# Altium project power-v3.5.PrjPCB (part 1 of 2)
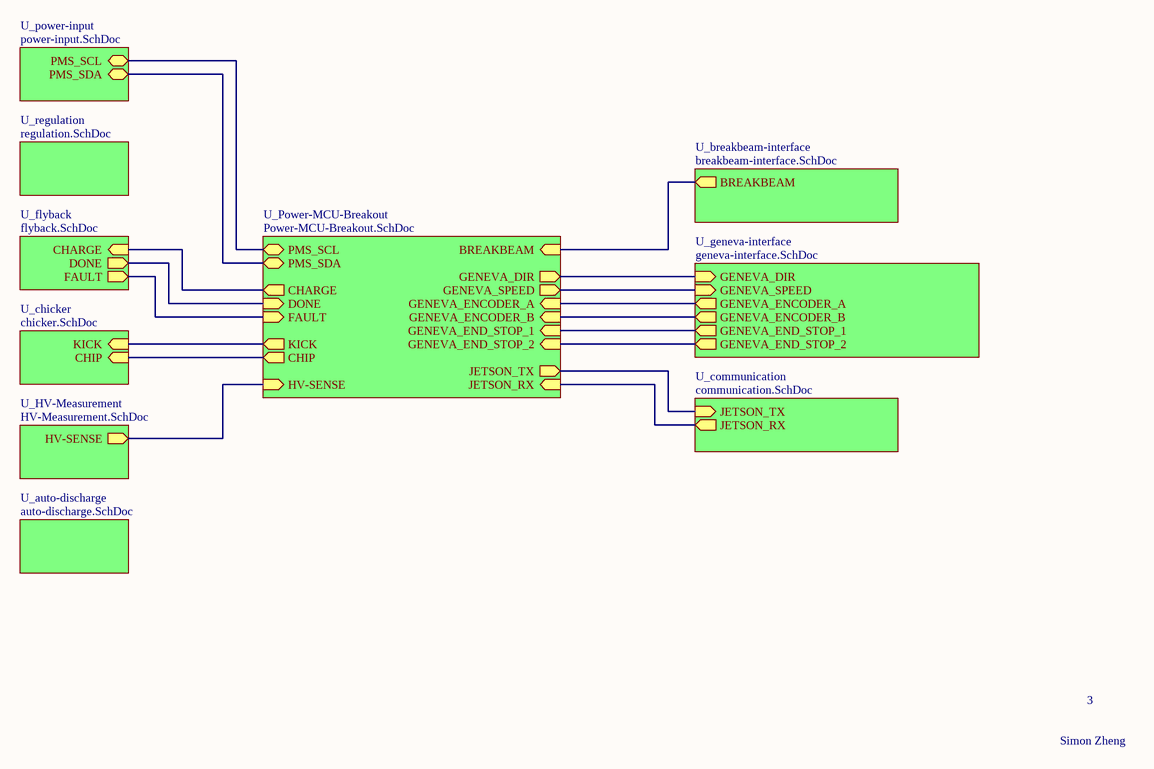
[diagram p0: power-v3.5.SchDoc]
11 sheets, 254 parts. Net scope: hierarchical (ports join the sheet entries above them; power ports are global).
Board files: power-v3.2-exp.PcbDoc, power-v3.5.PcbDoc
Sheets:
  power-v3.5.SchDoc
    U_auto-discharge = auto-discharge.SchDoc
    U_breakbeam-interface = breakbeam-interface.SchDoc
    U_chicker = chicker.SchDoc
    U_communication = communication.SchDoc
    U_flyback = flyback.SchDoc
    U_geneva-interface = geneva-interface.SchDoc
    U_HV-Measurement = HV-Measurement.SchDoc
    U_power-input = power-input.SchDoc
    U_Power-MCU-Breakout = Power-MCU-Breakout.SchDoc
    U_regulation = regulation.SchDoc

## Sheet power-v3.5.SchDoc
size A4; SheetNumber: 1

### Sub-sheets
U_auto-discharge = auto-discharge.SchDoc: no entries
U_breakbeam-interface = breakbeam-interface.SchDoc: BREAKBEAM (out)
U_chicker = chicker.SchDoc: CHIP (in), KICK (in)
U_communication = communication.SchDoc: JETSON_TX (in), JETSON_RX (out)
U_flyback = flyback.SchDoc: CHARGE (in), FAULT (out), DONE (out)
U_geneva-interface = geneva-interface.SchDoc: GENEVA_SPEED (in), GENEVA_ENCODER_A (out), GENEVA_ENCODER_B (out), GENEVA_DIR (in), GENEVA_END_STOP_1 (out), GENEVA_END_STOP_2 (out)
U_HV-Measurement = HV-Measurement.SchDoc: HV-SENSE (out)
U_power-input = power-input.SchDoc: PMS_SDA (bidir), PMS_SCL (bidir)
U_Power-MCU-Breakout = Power-MCU-Breakout.SchDoc: GENEVA_END_STOP_1 (in), GENEVA_END_STOP_2 (in), HV-SENSE (in), BREAKBEAM (in), FAULT (in), DONE (in), CHARGE (out), GENEVA_DIR (out), JETSON_TX (out), JETSON_RX (in), GENEVA_ENCODER_A (in), GENEVA_ENCODER_B (in), GENEVA_SPEED (out), KICK (out), CHIP (out), PMS_SCL (bidir), PMS_SDA (bidir)
U_regulation = regulation.SchDoc: no entries

### Nets
BREAKBEAM: sheet U_breakbeam-interface/BREAKBEAM, sheet U_Power-MCU-Breakout/BREAKBEAM
CHARGE: sheet U_flyback/CHARGE, sheet U_Power-MCU-Breakout/CHARGE
CHIP: sheet U_chicker/CHIP, sheet U_Power-MCU-Breakout/CHIP
DONE: sheet U_flyback/DONE, sheet U_Power-MCU-Breakout/DONE
FAULT: sheet U_flyback/FAULT, sheet U_Power-MCU-Breakout/FAULT
GENEVA_DIR: sheet U_geneva-interface/GENEVA_DIR, sheet U_Power-MCU-Breakout/GENEVA_DIR
GENEVA_ENCODER_A: sheet U_geneva-interface/GENEVA_ENCODER_A, sheet U_Power-MCU-Breakout/GENEVA_ENCODER_A
GENEVA_ENCODER_B: sheet U_geneva-interface/GENEVA_ENCODER_B, sheet U_Power-MCU-Breakout/GENEVA_ENCODER_B
GENEVA_END_STOP_1: sheet U_geneva-interface/GENEVA_END_STOP_1, sheet U_Power-MCU-Breakout/GENEVA_END_STOP_1
GENEVA_END_STOP_2: sheet U_geneva-interface/GENEVA_END_STOP_2, sheet U_Power-MCU-Breakout/GENEVA_END_STOP_2
GENEVA_SPEED: sheet U_geneva-interface/GENEVA_SPEED, sheet U_Power-MCU-Breakout/GENEVA_SPEED
HV-SENSE: sheet U_HV-Measurement/HV-SENSE, sheet U_Power-MCU-Breakout/HV-SENSE
JETSON_RX: sheet U_communication/JETSON_RX, sheet U_Power-MCU-Breakout/JETSON_RX
JETSON_TX: sheet U_communication/JETSON_TX, sheet U_Power-MCU-Breakout/JETSON_TX
KICK: sheet U_chicker/KICK, sheet U_Power-MCU-Breakout/KICK
PMS_SCL: sheet U_power-input/PMS_SCL, sheet U_Power-MCU-Breakout/PMS_SCL
PMS_SDA: sheet U_power-input/PMS_SDA, sheet U_Power-MCU-Breakout/PMS_SDA

### Notes on the sheet
- 3
- Simon Zheng

## Sheet auto-discharge.SchDoc
size A; SheetNumber: 5
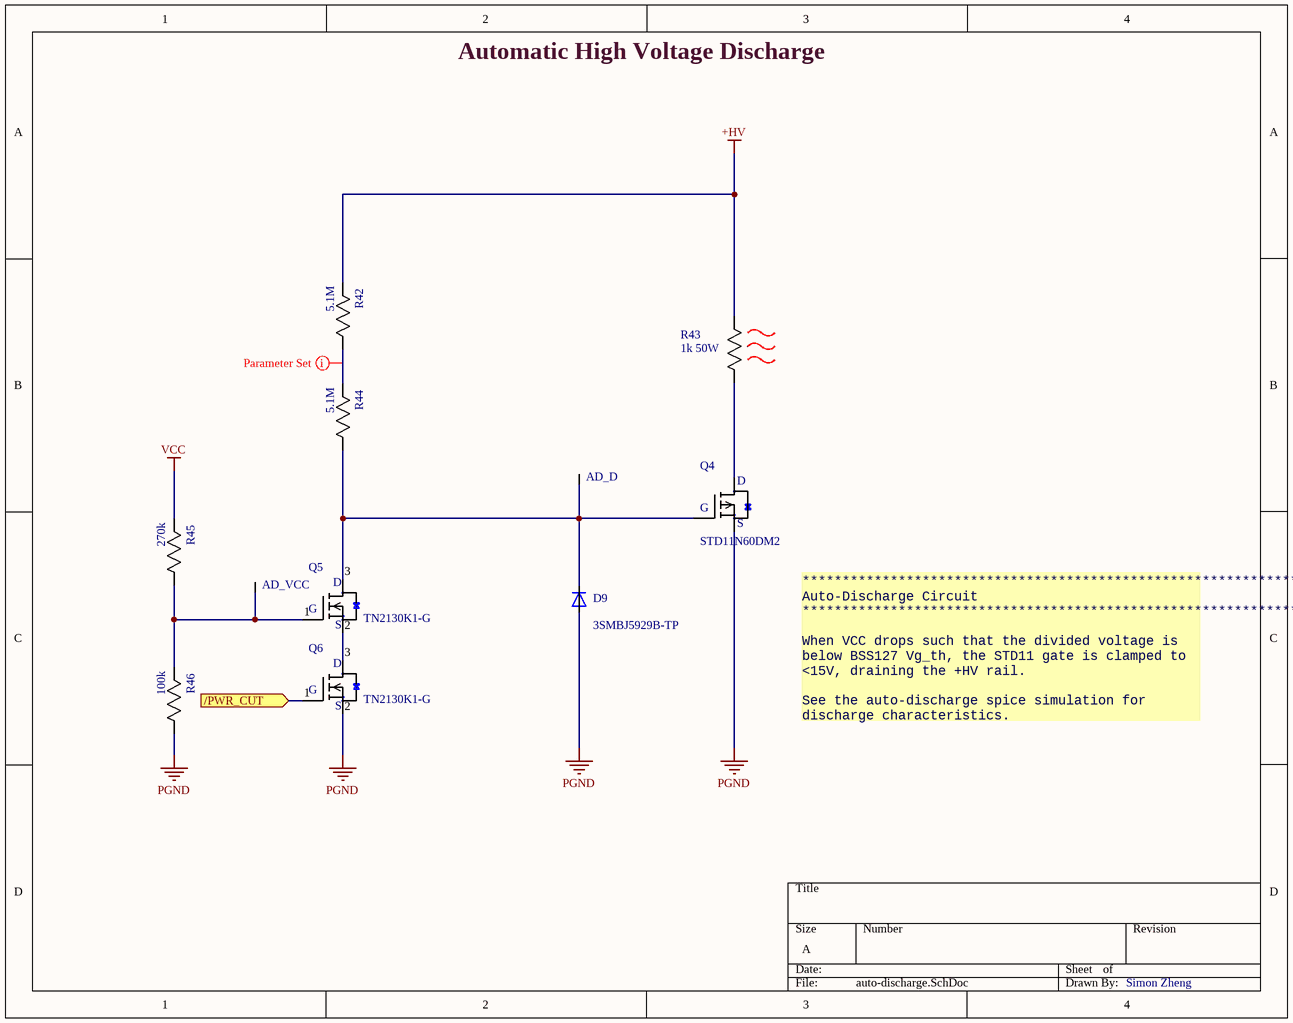
[diagram p1: auto-discharge.SchDoc]

### Parts
AD_D  Test Point (Via)  [TP]  (value not drawn)  (no BOM)
AD_VCC  Test Point (Via)  [TP]  (value not drawn)  (no BOM)
D9  3SMBJ5929B-TP  [DO-214AA]
Q4  STD11N60DM2  [DPAK (TO-252)]
Q5  TN2130K1-G  [SOT95P237X112-3N]
Q6  TN2130K1-G  [SOT95P237X112-3N]
R42  5.1M  [0603]
R43  1k 50W  [D2PAK (TO-263)]
R44  5.1M  [0603]
R45  270k  [0603]
R46  100k  [0603]

### Ports
/PWR_CUT (in)

### Nets
+HV: R42.2(R2) R43.2(R2)
PGND: D9.A Q4.S Q6.2(S) R46.1(R1)
VCC: R45.2(R2)
/PWR_CUT: Q6.1(G) ; port /PWR_CUT
NetAD_D_1: AD_D.1 D9.C Q4.G Q5.3(D) R44.1(R1)
NetAD_VCC_1: AD_VCC.1 Q5.1(G) R45.1(R1) R46.2(R2)
NetQ4_D: Q4.D R43.1(R1)
NetQ5_2: Q5.2(S) Q6.3(D)
NetR42_1: R42.1(R1) R44.2(R2)

Not connected (* = marked no-connect by the designer): R43 3

### Layout directives
net class HighVoltage: NetR42_1

### Notes on the sheet
- Automatic High Voltage Discharge
- **********************************************************************
  Auto-Discharge Circuit
  **********************************************************************
  When VCC drops such that the divided voltage is below BSS127 Vg_th, the STD11 gate is clamped to <15V, draining the +HV rail.
  See the auto-discharge spice simulation for discharge characteristics.
- Simon Zheng

### Library data of the parts
D9 = DIODE ZENER 15V 3W: Supplier 1: Digi-Key; Supplier Part Number 1: 3SMBJ5929BTPMSCT-ND; Part Number: DIODE ZENER 15V 3W; Pin Count: 2
Q4 = STD11N60DM2: pin to pad: D>2 G>1 S>3; MFG: STMicroelectronics; Supplier: Digikey; Supplier PN: 497-16925-1-ND; Part Number: STD11N60DM2
Q5 Q6 = MOSFET N-CH TN2130K1-G: N-Channel 300 V 85mA (Tj) 360mW (Tc) Surface Mount TO-236AB (SOT23); Mfr_Name: Microchip; Type: DEV; Copyright: Copyright (C) 2021 Ultra Librarian. All rights reserved.; Manufacturer_Part_Number: TN2130K1-G; Digi-Key_Part_Number_1: TN2130K1-GCT-ND; Digi-Key_Part_Number_2: TN2130K1-GDKR-ND; Digi-Key_Part_Number_3: TN2130K1-GTR-ND; RefDes: RefDes; Supplier 1: Digi-Key; Supplier Part Number 1: TN2130K1-GCT-ND; Part Number: MOSFET N-CH TN2130K1-G; Manufacturer Part Number 1: TN2130K1-G; Supplier URL 1: https://www.digikey.com/en/products/detail/microchip-technology/TN2130K1-G/4902939
R42 R44 = RES 5.1M 1/8W-5%: RES SMD 5.1 MOHM 5% 1/8W 0603; Power (Watts): 0.125W; Package: 0805; Value: 5.1M; Tolerance: 5%; Part Number: RES 5.1M 1/8W-5%
R43 = RES 1.5k 50W: RES SMD 1.5K OHM 1% 50W D2PAK; Package: D2PAK (TO-263); Value: 1.5k; Power (Watts): 50W; Tolerance: 1%; Part Number: RES 1.5k 50W
R45 = RES 270k 1/8W: RES SMD 270K OHM 5% 1/8W 0603; Power (Watts): 0.125W; Package: 0805; Value: 270k; Tolerance: 5%; Part Number: RES 270k 1/8W
R46 = RES 100k 1/8W - 1%: RES SMD 100K OHM 1% 1/8W 0603; Manufacturer Part Number 1: ERJ-H3GJ104V; Power (Watts): 0.125W; Package: 0805; Value: 100k; Tolerance: 1%; Part Number: RES 100k 1/8W - 1%; Supplier 1: Digi-Key; Supplier Part Number 1: 10-ERJ-H3GJ104VCT-ND; Supplier URL 1: https://www.digikey.ca/en/products/detail/panasonic-electronic-components/ERJ-H3GJ104V/13877854?s=N4IgTCBcDaIIwAYC0BRASgKSQCQMwHENEAWANQGEAVJAOQBEQBdAXyA
AD_D AD_VCC = Test Point (Via): Part Number: Test Point (Via)

## Sheet breakbeam-interface.SchDoc
size A4
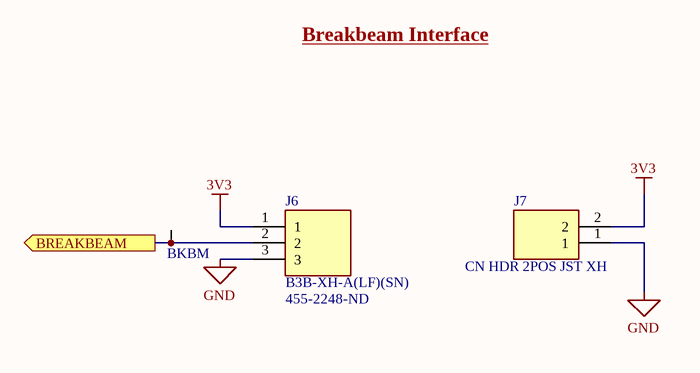
[diagram p2: breakbeam-interface.SchDoc]

### Parts
BKBM  Test Point (Via)  [TP]  (value not drawn)  (no BOM)
J6  B3B-XH-A(LF)(SN)  Supplier Part Number 1: 455-2248-ND  [JST_B3B-XH-A(LF)(SN)]
J7  CN HDR 2POS JST XH  [JST_B2B-XH-A(LF)(SN)]

### Ports
BREAKBEAM (out)

### Nets
3V3: J6.1 J7.2
GND: J6.3 J7.1
BREAKBEAM: BKBM.1 J6.2 ; port BREAKBEAM

### Notes on the sheet
- Breakbeam Interface

### Library data of the parts
J6 = CN HDR 3POS JST XH: Connector Header Through Hole 3 position 0.098 (2.50mm); MF: JST Sales; Check_prices: https://www.snapeda.com/parts/B3B-XH-A(LF)(SN)/JST%20Sales%20America%20Inc./view-part/231271/?ref=eda; Value: *; Package: None; Price: None; Availability: In Stock; MP: B3B-XH-A(LF)(SN); SnapEDA_Link: https://www.snapeda.com/parts/B3B-XH-A(LF)(SN)/JST%20Sales%20America%20Inc./view-part/231271/?ref=snap; Supplier 1: Digi-Key; Part Number: CN HDR 3POS JST XH; Manufacturer Part Number 1: B3B-XH-A(LF)(SN); Supplier URL 1: https://www.digikey.com/en/products/detail/jst-sales-america-inc/B3B-XH-A-LF-SN/1651046
J7 = CN HDR 2POS JST XH: Connector Header Through Hole 2 position 0.098 _2.50mm_ / JST XH; MP: B2B-XH-A_LF__SN_; MF: JST Sales; Price: None; Package: None; Value: *; SnapEDA_Link: https://www.snapeda.com/parts/B2B-XH-A%28LF%29%28SN%29/JST%20Sales%20America%20Inc./view-part/492310/?ref=snap; Part Number: CN HDR 2POS JST XH; Pin Count: 2
BKBM = Test Point (Via): Part Number: Test Point (Via)

## Sheet chicker.SchDoc
size A4; SheetNumber: 7
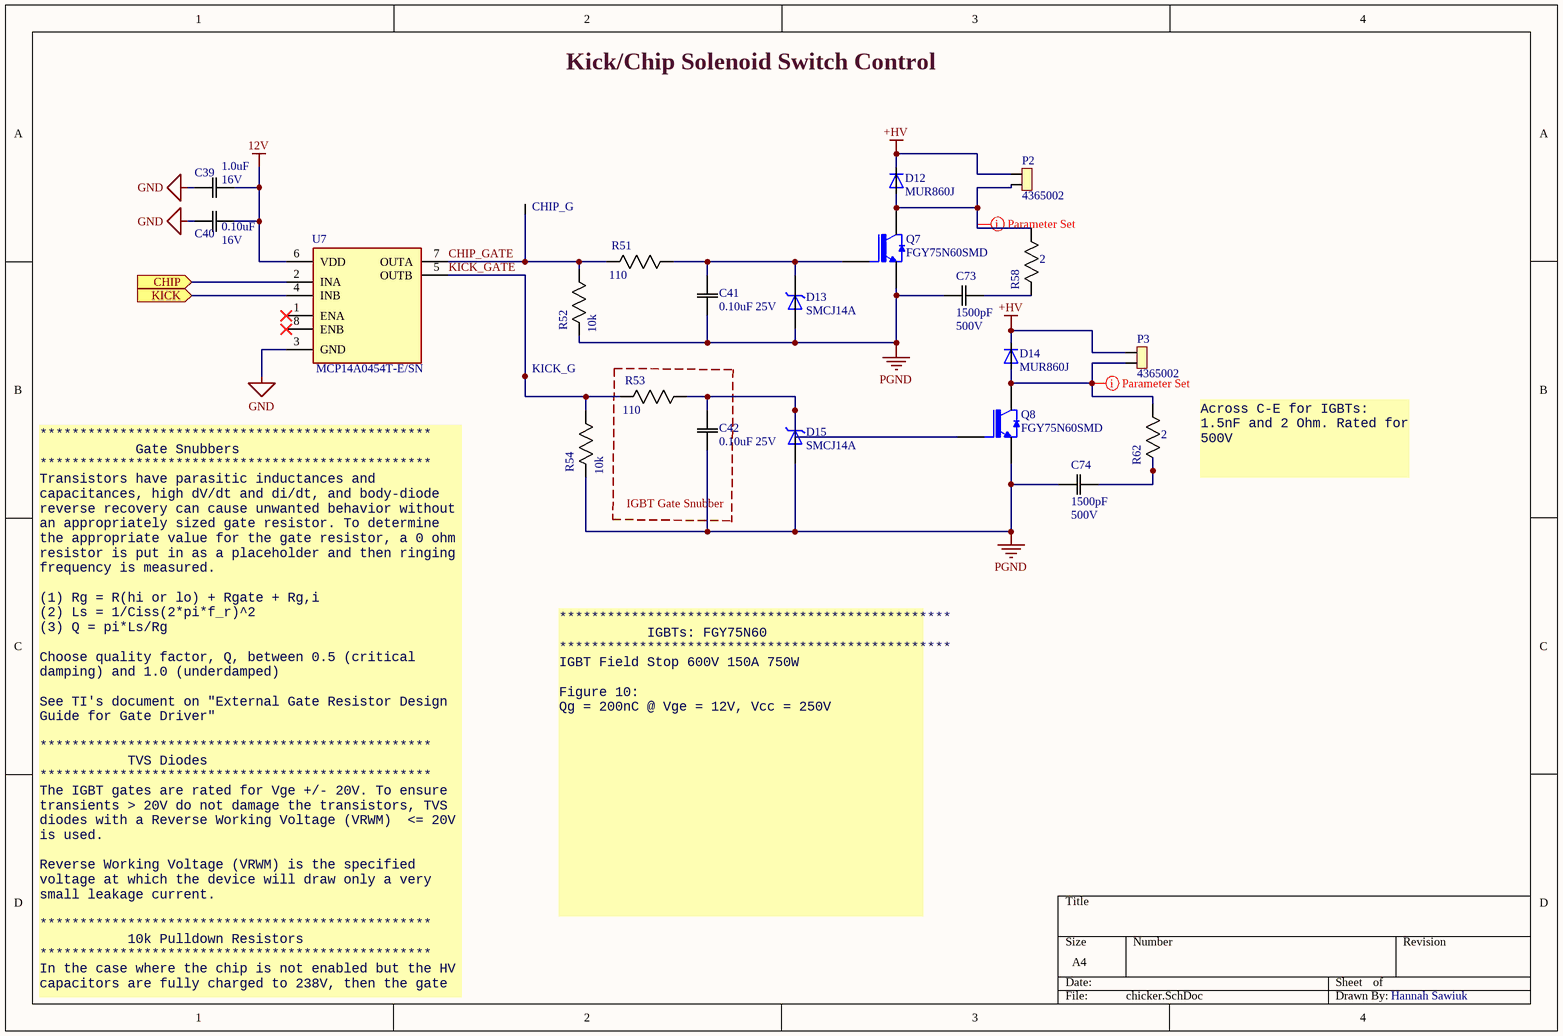
[diagram p3: chicker.SchDoc]

### Parts
(Parts that share a designator on the sheet are numbered #1, #2 ... from top to bottom, then left to right.)
C39  Rating: 16V  [0603]  (hidden comment: 1.0uF)
C40  Rating: 16V  [0603]  (hidden comment: 0.10uF)
C41  0.10uF 25V  [0805]
C42  0.10uF 25V  [0805]
C73  Rating: 500V  [0805]  (hidden comment: 1500pF)
C74  Rating: 500V  [0805]  (hidden comment: 1500pF)
CHIP_G  Test Point (Via)  [TP]  (value not drawn)  (no BOM)
D12  MUR860J  [DO-214AB-DIODES]
D13  SMCJ14A  [DIOM7959X262N]
D14  MUR860J  [DO-214AB-DIODES]
D15  SMCJ14A  [DIOM7959X262N]
KICK_G  Test Point (Via)  [TP]  (value not drawn)  (no BOM)
P2  4365002  [43650-02]
P3  4365002  [43650-02]
Q7  FGY75N60SMD  [TO-247-3 - FaceDown]
Q8  FGY75N60SMD  [TO-247-3 - FaceDown]
R51  110  [0603]
R52  10k  [0603]
R53  110  [0603]
R54  10k  [0603]
R58  2  [0603]
R62#1  2  [0603]
U7  MCP14A0454T-E/SN  [8-SOIC]

### Ports
CHIP (in), KICK (in)

### Nets
12V: C39.2(C2) C40.2(C2) U7.6(VDD)
+HV: D12.1(C) D14.1(C) P2.2 P3.2
GND: C39.1(C1) C40.1(C1) U7.3(GND)
PGND: C41.1(C1) C42.1(C1) C73.2(C2) C74.2(C2) D13.A D15.A Q7.3(E) Q8.3(E) R52.2(R2) R54.2(R2)
CHIP: U7.2(INA) ; port CHIP
CHIP_GATE: CHIP_G.1 R51.2(R2) R52.1(R1) U7.7(OUTA)
KICK: U7.4(INB) ; port KICK
KICK_GATE: KICK_G.1 R53.2(R2) R54.1(R1) U7.5(OUTB)
NetC41_2: C41.2(C2) D13.C Q7.1(G) R51.1(R1)
NetC42_2: C42.2(C2) D15.C Q8.1(G) R53.1(R1)
NetC73_1: C73.1(C1) R58.2(R2)
NetC74_1: C74.1(C1) R62#1.2(R2)
NetD12_2: D12.2(A) P2.1 Q7.2(C) R58.1(R1)
NetD14_2: D14.2(A) P3.1 Q8.2(C) R62#1.1(R1)

Not connected (* = marked no-connect by the designer): U7 1(ENA)* 8(ENB)*

### Layout directives
net class HighVoltage: NetD12_2, NetD14_2

### Notes on the sheet
- Kick/Chip Solenoid Switch Control
- IGBT Gate Snubber
- Across C-E for IGBTs: 1.5nF and 2 Ohm. Rated for 500V
- *************************************************
  IGBTs: FGY75N60
  *************************************************
  IGBT Field Stop 600V 150A 750W
  Figure 10:
  Qg = 200nC @ Vge = 12V, Vcc = 250V
- *************************************************
  Gate Snubbers
  *************************************************
  Transistors have parasitic inductances and capacitances, high dV/dt and di/dt, and body-diode reverse recovery can cause unwanted behavior without an appropriately sized gate resistor. To determine the appropriate value for the gate resistor, a 0 ohm resistor is put in as a placeholder and then ringing frequency is measured.
  (1) Rg = R(hi or lo) + Rgate + Rg,i
  (2) Ls = 1/Ciss(2*pi*f_r)^2
  (3) Q = pi*Ls/Rg
  Choose quality factor, Q, between 0.5 (critical damping) and 1.0 (underdamped)
  See TI's document on "External Gate Resistor Design Guide for Gate Driver"
  *************************************************
  TVS Diodes
  *************************************************
  The IGBT gates are rated for Vge +/- 20V. To ensure transients > 20V do not damage the transistors, TVS diodes with a Reverse Working Voltage (VRWM)  <= 20V is used.
  Reverse Working Voltage (VRWM) is the specified voltage at which the device will draw only a very small leakage current.
  *************************************************
  10k Pulldown Resistors
  *************************************************
  In the case where the chip is not enabled but the HV capacitors are fully charged to 238V, then the gate of the IGBTs would be floating, and there could be the case where the gate rises above 12V, turning the IGBTs on. This could lead to a safety hazard due to the uncontrolled kicker/chipper action. By pulling down the gates with a 10k resistor, the IGBTs will remain off whenever the gate driver is not enabled.
- Hannah Sawiuk

### Library data of the parts
C39 = CAP 1.0uF 16V: CAP CER 1.0UF 16V X5R 0603/0805; Tolerance: 10%; Package: 0603/0805; Temperature Coefficient: X5R; Operating Temperature: -55°C ~ 85°C; Value: 1.0uF; Part Number: CAP 1.0uF 16V
C40 = CAP 0.10uF 16V: CAP CER 0.10UF 16V X5R 0603; Tolerance: 10%; Temperature Coefficient: X5R; Value: 0.10uF; Part Number: CAP 0.10uF 16V; Package: 0603/0805; Operating Temperature: -55°C ~ 85°C
C41 C42 = CAP 0.10uF 25V: CAP CER 0.10UF 25V X7R 0805; Tolerance: 10%; Value: 0.10uF; Temperature Coefficient: X7R; Rating: 25V; Operating Temperature: -55°C ~ 125°C; Part Number: CAP 0.10uF 25V
C73 C74 = CAP 1500pF 500V - 0805: Default Symbol for Capacitors; Temperature Coefficient: X7R; Value: 1500pF; Part Number: CAP 1500pF 500V - 0805
D12 D14 = DIODE FAST 600V 8A: Diode Standard 600 V 8A Surface Mount SMC; ComponentLink1Description: Octopart Link; ComponentLink1URL: https://octopart.com/search?q=MUR860J&currency=USD&specs=0; Supplier 1: Digi-Key; Supplier Part Number 1: 1740-MUR860JCT-ND; Part Number: DIODE FAST 600V 8A; Manufacturer Part Number 1: MUR860J; Supplier URL 1: https://www.digikey.com/en/products/detail/ween-semiconductors/MUR860J/11630078
D13 D15 = DIODE TVS 14VR 15.6VBR: 23.2V Clamp 64.7A Ipp Tvs Diode Surface Mount DO-214AB (SMC), VR = 14V, VBR = 15.6V; Package: None; Price: None; Value: *; MP: SMCJ14A; Availability: Unavailable; Supplier 1: Digi-Key; Supplier 2: Mouser; Supplier Part Number 1: SMCJ14ALFCT-ND; Supplier Part Number 2: 652-SMCJ14A; Part Number: DIODE TVS 14VR 15.6VBR; Manufacturer Part Number 1: SMCJ14A; Supplier URL 1: https://www.digikey.com/en/products/detail/littelfuse-inc/SMCJ14A/762380
P2 P3 = CN MOLEX 4365002XX: MOLEX MICROFIT 2CKT RIGHT THRU; MF: MOLEX; MP: 4365002XX; Digikey: WM17581-ND; Digikey Link: https://www.digikey.com/en/products/detail/molex/0436500205/3310532?s=N4IgTCBcDaICwGYBsBWADGsaUgLoF8g; Package: Microfit; Price: 1.44 CAD; Value: N/A; Supplier 1: Digi-Key; Part Number: CN MOLEX 4365002XX; Supplier URL 1: https://www.digikey.com/en/products/detail/molex/0436500205/3310532?s=N4IgTCBcDaICwGYBsBWADGsaUgLoF8g; Pin Count: 2
Q7 Q8 = FGY75N60SMD: IGBT Field Stop 600V 150A 750W Through Hole PowerTO-247-3; MF: ON Semiconductor; Package: TO-247 Fairchild Semiconductor; MP: FGY75N60SMD; Supplier 1: Digi-Key; Supplier Part Number 1: FGY75N60SMDFS-ND; Part Number: FGY75N60SMD
R51 R53 = RES 110.0 1/8W - 1%: RES SMD 110 OHM 1% 1/8W 0603; Manufacturer Part Number 1: RMCF0603FT110R; Power (Watts): 0.125W; Package: 0603; Value: 110; Tolerance: 1%; Part Number: RES 110.0 1/8W - 1%; Supplier 1: Digi-Key; Supplier Part Number 1: RMCF0603FT110RCT-ND; Supplier URL 1: https://www.digikey.ca/en/products/detail/stackpole-electronics-inc/RMCF0603FT110R/1761268
R52 R54 = RES 10k 1/8W - 1%: RES SMD 10K OHM 1% 1/8W 0603; Manufacturer Part Number 1: ERJ-H3GJ103V; Power (Watts): 0.125W; Tolerance: 5%; Package: 0805; Value: 10k; Part Number: RES 10k 1/8W - 1%; Supplier 1: Digi-Key; Supplier Part Number 1: 10-ERJ-H3GJ103VCT-ND; Supplier URL 1: https://www.digikey.ca/en/products/detail/panasonic-electronic-components/ERJ-H3GJ103V/13877876?s=N4IgTCBcDaIIwAYC0BRASgKSQCQMwHENFcA1AYQBUkA5AERAF0BfIA; Manufacturer Part Number 2: RMCF0805JT10K0; Supplier 2: Digi-Key; Supplier Part Number 2: RMCF0805JT10K0CT-ND; Supplier URL 2: https://www.digikey.ca/en/products/detail/stackpole-electronics-inc/RMCF0805JT10K0/1757762?s=N4IgTCBcDaIEoFkDCAxADADjQVgFIBUBGNAaTSXxAF0BfIA; Tolerance 2: 5%
R58 R62#1 = RES 2.0 1/8W: Default Resistor Symbol; Power (Watts): 0.125W; Tolerance: 5%; Package: 0805; Value: 2; Part Number: RES 2.0 1/8W
U7 = MCP14A0454T-E_SN: IC GATE DRVR LOW-SIDE 8SOIC; Supplier 1: Digi-key; Supplier Part Number 1: MCP14A0454T-E/SNCT-ND; Part Number: MCP14A0454T-E_SN; Manufacturer Part Number 1: MCP14A0454T-E/SN; Supplier URL 1: https://www.digikey.com/en/products/detail/microchip-technology/MCP14A0454T-E-SN/8639009?s=N4IgTCBcDaILIGEAKBGALAQQAxoKxoBUBaAUQHoBlAORAF0BfIA
CHIP_G KICK_G = Test Point (Via): Part Number: Test Point (Via)

## Sheet communication.SchDoc
size A4; SheetNumber: 8
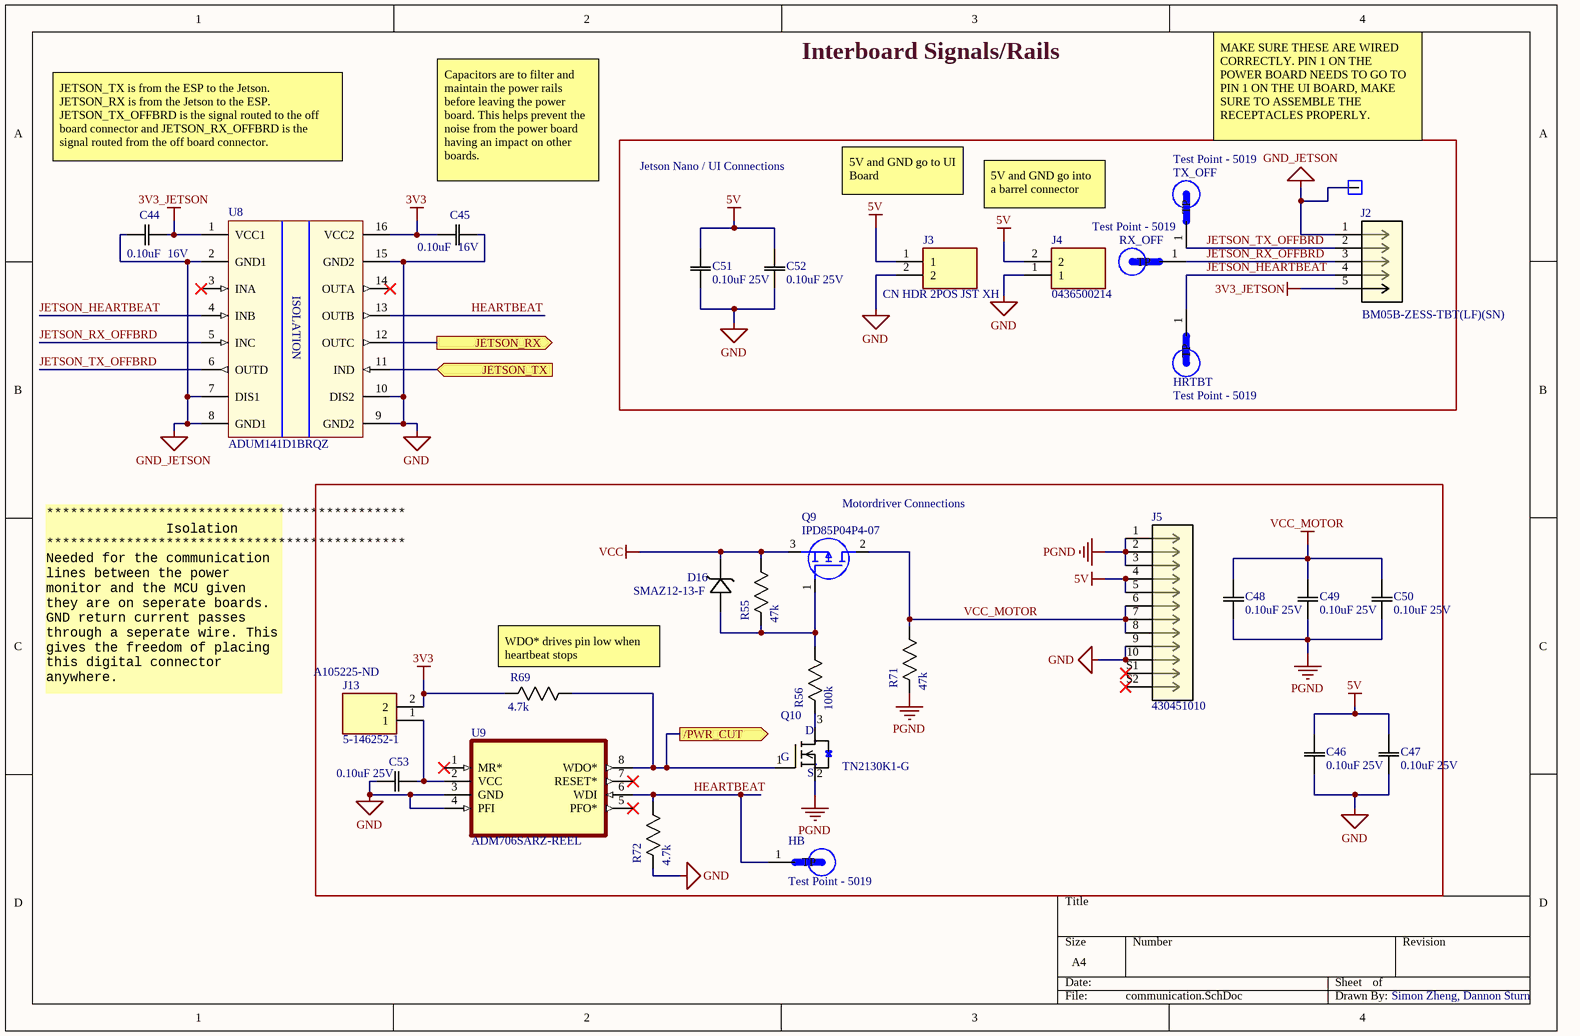
[diagram p4: communication.SchDoc]

### Parts
C44  Rating: 16V  [0603]  (hidden comment: 0.10uF)
C45  Rating: 16V  [0603]  (hidden comment: 0.10uF)
C46  0.10uF 25V  [0603]
C47  0.10uF 25V  [0603]
C48  0.10uF 25V  [0603]
C49  0.10uF 25V  [0603]
C50  0.10uF 25V  [0603]
C51  0.10uF 25V  [0603]
C52  0.10uF 25V  [0603]
C53  0.10uF 25V  [0603]
D16  SMAZ12-13-F  [SMA_DIO-L]
HB  Test Point - 5019  [TP380X203]
HRTBT  Test Point - 5019  [TP380X203]
J2  BM05B-ZESS-TBT(LF)(SN)  [JST ZE SMT 5POS]
J3  CN HDR 2POS JST XH  [JST_B2B-XH-A(LF)(SN)]
J4  0436500214  [43650-0214]
J5  430451010  [CON_430451010_MOL]
J13  5-146252-1  Supplier Part Number 1: A105225-ND  [TE_5-146252-1]
JETSON_GND  Breakout Pin 0603  [BreakoutPin 0603]  (value not drawn)
Q9  IPD85P04P4-07  [DPAK (TO-252)]
Q10  TN2130K1-G  [SOT95P237X112-3N]
R55  47k  [0603]
R56  100k  [0603]
R69  4.7k  [0603]
R71  47k  [0603]
R72  4.7k  [0603]
RX_OFF  Test Point - 5019  [TP380X203]
TX_OFF  Test Point - 5019  [TP380X203]
U8  ADUM141D1BRQZ  [SOP64P600X175-16N]
U9  ADM706SARZ-REEL  [SOIC127P600X175-8N]

### Blocks framed on the sheet
Jetson Nano / UI Connections: C51 C52 HRTBT J2-J4 JETSON_GND RX_OFF TX_OFF
Motordriver Connections: C46-C50 C53 D16 HB J5 J13 Q9 Q10 R55 R56 R69 R71 R72 U9

### Ports
/PWR_CUT (out), JETSON_RX (out), JETSON_TX (in)

### Nets
3V3: C45.2(C2) J13.2 R69.2(R2) U8.16(VCC2)
3V3_JETSON: C44.2(C2) J2.5 U8.1(VCC1)
5V: C46.2(C2) C47.2(C2) C51.2(C2) C52.2(C2) J3.1 J4.2 J5.4 J5.5
GND: C45.1(C1) C46.1(C1) C47.1(C1) C51.1(C1) C52.1(C1) C53.1(C1) J3.2 J4.1 J5.9 J5.10 R72.2(R2) U8.9(GND2) U8.10(DIS2) U8.15(GND2) U9.3(GND) U9.4(PFI)
GND_JETSON: C44.1(C1) J2.1 JETSON_GND.1(BRKOUT) U8.2(GND1) U8.7(DIS1) U8.8(GND1)
PGND: C48.1(C1) C49.1(C1) C50.1(C1) J5.1 J5.2 J5.3 Q10.2(S) R71.2(R2)
VCC: D16.1 Q9.3(S) R55.1(R1)
VCC_MOTOR: C48.2(C2) C49.2(C2) C50.2(C2) J5.6 J5.7 J5.8 Q9.2(D) R71.1(R1)
/PWR_CUT: Q10.1(G) R69.1(R1) U9.8(WDO*) ; port /PWR_CUT
HEARTBEAT: HB.1(TP) R72.1(R1) U8.13(OUTB) U9.6(WDI)
JETSON_HEARTBEAT: HRTBT.1(TP) J2.4 U8.4(INB)
JETSON_RX: U8.12(OUTC) ; port JETSON_RX
JETSON_RX_OFFBRD: J2.3 RX_OFF.1(TP) U8.5(INC)
JETSON_TX: U8.11(IND) ; port JETSON_TX
JETSON_TX_OFFBRD: J2.2 TX_OFF.1(TP) U8.6(OUTD)
NetC53_2: C53.2(C2) J13.1 U9.2(VCC)
NetD16_2: D16.2 Q9.1(G) R55.2(R2) R56.1(R1)
NetQ10_3: Q10.3(D) R56.2(R2)

Not connected (* = marked no-connect by the designer): J5 S1* S2*; U8 3(INA)* 14(OUTA)*; U9 1(MR*)* 5(PFO*)* 7(RESET*)*

### Notes on the sheet
- Interboard Signals/Rails
- JETSON_TX is from the ESP to the Jetson. JETSON_RX is from the Jetson to the ESP.
  JETSON_TX_OFFBRD is the signal routed to the off board connector and JETSON_RX_OFFBRD is the signal routed from the off board connector.
- Capacitors are to filter and maintain the power rails before leaving the power board. This helps prevent the noise from the power board having an impact on other boards.
- (near JETSON_GND) MAKE SURE THESE ARE WIRED CORRECTLY. PIN 1 ON THE POWER BOARD NEEDS TO GO TO PIN 1 ON THE UI BOARD, MAKE SURE TO ASSEMBLE THE RECEPTACLES PROPERLY.
- 5V and GND go to UI Board
- 5V and GND go into a barrel connector
- *********************************************
  Isolation
  *********************************************
  Needed for the communication lines between the power monitor and the MCU given they are on seperate boards. GND return current passes through a seperate wire. This gives the freedom of placing this digital connector anywhere.
- (near R69) WDO* drives pin low when heartbeat stops
- Simon Zheng, Dannon Sturn
- (in symbol ISO ADUM141D1BRQZ) ISOLATION

### Library data of the parts
C44 C45 = CAP 0.10uF 16V: as C40 on sheet chicker; Temperature Coefficient: X5R; Value: 0.10uF; Part Number: CAP 0.10uF 16V; Package: 0603/0805; Operating Temperature: -55°C ~ 85°C
C46-C53 = CAP 0.10uF 25V: CAP CER 0.10UF 25V X7R 0603; Tolerance: 10%; Value: 0.10uF; Temperature Coefficient: X7R; Rating: 25V; Operating Temperature: -55°C ~ 125°C; Part Number: CAP 0.10uF 25V
D16 = DIODE ZENER 12V 1W: Zener Diode 12 V 1 W ±5% Surface Mount SMA; Mfr_Name: Diodes Inc; Type: DEV; Copyright: Copyright (C) 2021 Ultra Librarian. All rights reserved.; Manufacturer_Part_Number: SMAZ12-13-F; Digi-Key_Part_Number_1: SMAZ12-FDICT-ND; Digi-Key_Part_Number_2: SMAZ12-FDIDKR-ND; Digi-Key_Part_Number_3: SMAZ12-FDITR-ND; RefDes: RefDes; Supplier 1: Digi-Key; Supplier 2: Newark; Supplier 3: Digi-Key; Supplier Part Number 1: SMAZ12-FDICT-ND; Supplier Part Number 2: 23T8541; Supplier Part Number 3: SMAZ12-FDICT-ND; Part Number: DIODE ZENER 12V 1W; Manufacturer Part Number 1: SMAZ12-13-F; Supplier URL 1: https://www.digikey.com/en/products/detail/SMAZ12-13-F/SMAZ12-FDICT-ND/725073?curr=usd&utm_campaign=buynow&utm_medium=aggregator&utm_source=octopart
HB HRTBT RX_OFF TX_OFF = Test Point - 5019: PC Test Point, Miniature Phosphor Bronze, Silver Plating Surface Mount Mounting Type; MP: 5019; MF: Keystone Electronics; Value: *; Package: 2010 Keystone; Part Number: Test Point - 5019
J2 = CN 5POS JST ZE SMT: CONN HEADER VERT SMD 5POS ZE; Part Number: CN 5POS JST ZE SMT; Manufacturer Part Number 1: BM05B-ZESS-TBT(LF)(SN); Supplier 1: Digi-Key; Supplier Part Number 1: 455-2383-1-ND; Supplier URL 1: https://www.digikey.ca/en/products/detail/jst-sales-america-inc/BM05B-ZESS-TBT-LF-SN/1886989?s=N4IgTCBcDaIEIFkAMBWOBaAWgUQMq-QBU5CAKAGQDEBKU3AOWpAF0BfIA; Pin Count: 5
J3 = CN HDR 2POS JST XH: as J7 on sheet breakbeam-interface; Price: None; Package: None; Value: *; SnapEDA_Link: https://www.snapeda.com/parts/B2B-XH-A%28LF%29%28SN%29/JST%20Sales%20America%20Inc./view-part/492310/?ref=snap; Part Number: CN HDR 2POS JST XH; Pin Count: 2
J4 = CN HDR 2POS Molex 0436500214: Connector Header Surface Mount, Right Angle 2 position 0.118" (3.00mm); Manufacturer_Name: Molex; Datasheet Link: http://www.molex.com/webdocs/datasheets/pdf/en-us//0436500214_PCB_HEADERS.pdf; Manufacturer_Part_Number: 43650-0214; Supplier 1: Digi-Key; Supplier 2: Newark; Supplier 3: Arrow Electronics; Supplier 4: Mouser; Supplier Part Number 1: WM14310CT-ND; Supplier Part Number 2: 39AH6218; Supplier Part Number 3: 43650-0214; Supplier Part Number 4: 538-43650-0214; Part Number: CN HDR 2POS Molex 0436500214; Manufacturer Part Number 1: 0436500214; Supplier URL 1: https://www.digikey.com/en/products/detail/molex/0436500214/3310534
J5 = CN HDR 10POS MOLEX 430451010: Connector Header Surface Mount, Right Angle 10 position 0.118" (3.00mm); Mfr_Name: Molex Connector Corporation; Copyright: Copyright (C) 2021 Ultra Librarian. All rights reserved.; Manufacturer_Part_Number: 430451010; Digi-Key_Part_Number_1: WM3819TR-ND; Digi-Key_Part_Number_2: WM3819CT-ND; Digi-Key_Part_Number_3: WM3819DKR-ND; RefDes: RefDes; Type: DEV; Supplier 1: Digi-Key; Supplier 2: Newark; Supplier 3: Mouser; Supplier Part Number 1: WM3819CT-ND; Supplier Part Number 2: 03AH4054; Supplier Part Number 3: 538-43045-1010; Part Number: CN HDR 10POS MOLEX 430451010; Manufacturer Part Number 1: 430451010; Supplier URL 1: https://www.digikey.com/en/products/detail/molex/0430451010/2421710?s=N4IgTCBcDaICwGYAMcCsBGJmQF0C%2BQA
J13 = 5-146252-1: 2 Pin Jumper Male Pins and Cap; Package: None; Price: None; Value: *; MP: 5-146252-1; Availability: Unavailable; Supplier 1: Digi-Key; ComponentLink1Description: JumperPins; ComponentLink1URL: https://www.digikey.ca/en/products/detail/te-connectivity-amp-connectors/5-146252-1/2275768#; ComponentLink2Description: JumperCap; ComponentLink2URL: https://www.digikey.ca/en/products/detail/samtec-inc/SNT-100-BK-G/1756763; Part Number: 5-146252-1; Manufacturer Part Number 1: 5-146252-1; Supplier URL 1: https://www.digikey.com/en/products/detail/te-connectivity-amp-connectors/5-146252-1/2275768
JETSON_GND = Breakout Pin 0603: 0603 breakout pad; Part Number: Breakout Pin 0603
Q9 = MOSFET IPD85P04P4-07: P-Channel 40 V 85A (Tc) 88W (Tc) Surface Mount PG-TO252-3-313; Supplier 1: Digi-Key; Supplier 2: Mouser; Supplier 3: Digi-Key; Supplier Part Number 1: 448-IPD85P04P407ATMA1CT-ND; Supplier Part Number 2: 726-IPD85P04P4-07; Supplier Part Number 3: 448-IPD85P04P407ATMA1CT-ND; Part Number: MOSFET IPD85P04P4-07; Supplier URL 1: https://www.digikey.ca/en/products/detail/infineon-technologies/IPD85P04P407ATMA1/5960266
Q10 = MOSFET N-CH TN2130K1-G: as Q5 on sheet auto-discharge; Copyright: Copyright (C) 2021 Ultra Librarian. All rights reserved.; Manufacturer_Part_Number: TN2130K1-G; Digi-Key_Part_Number_1: TN2130K1-GCT-ND; Digi-Key_Part_Number_2: TN2130K1-GDKR-ND; Digi-Key_Part_Number_3: TN2130K1-GTR-ND; RefDes: RefDes; Supplier 1: Digi-Key; Supplier Part Number 1: TN2130K1-GCT-ND; Part Number: MOSFET N-CH TN2130K1-G; Manufacturer Part Number 1: TN2130K1-G; Supplier URL 1: https://www.digikey.com/en/products/detail/microchip-technology/TN2130K1-G/4902939
R55 R71 = RES 47k 1/8W - 5%: RES SMD 47k OHM 5% 1/8W 0603; Power (Watts): 0.125W; Package: 0805; Value: 47k; Tolerance: 5%; Part Number: RES 47k 1/8W - 5%
R56 = RES 100k 1/8W - 5%: RES SMD 100K OHM 5% 1/8W 0603; Power (Watts): 0.125W; Package: 0805; Value: 100k; Tolerance: 5%; Part Number: RES 100k 1/8W - 5%
R69 R72 = RES 4.7k 1/8W - 5%: RES SMD 4.7k OHM 5% 1/8W 0603; Manufacturer Part Number 1: RMCF0603JT4K70; Power (Watts): 0.125W; Package: 0805; Value: 4.7k; Tolerance: 5%; Part Number: RES 4.7k 1/8W - 5%; Supplier 1: Digi-Key; Supplier Part Number 1: RMCF0603JT4K70CT-ND; Supplier URL 1: https://www.digikey.ca/en/products/detail/stackpole-electronics-inc/RMCF0603JT4K70/1757976
U8 = ISO ADUM141D1BRQZ: Digital Isolator CMOS 4-CH 150Mbps 16-Pin QSOP T/R; Supplier 1: Digi-Key; Supplier Part Number 1: ADUM141D1BRQZ-ND; Part Number: ISO ADUM141D1BRQZ; Manufacturer Part Number 1: ADUM141D1BRQZ; Supplier URL 1: https://www.digikey.ca/en/products/detail/analog-devices-inc/ADUM141D1BRQZ/7606661
U9 = ADM706SARZ-REEL: MF: Analog Devices; MP: ADM706SARZ-REEL; Package: SOIC-8 Analog Devices; Value: *; SnapEDA_Link: https://www.snapeda.com/parts/ADM706SARZ-REEL/Analog+Devices/view-part/?ref=snap; Digi-Key_Part_Number: ADM706SARZ-REELCT-ND; Check_prices: https://www.snapeda.com/parts/ADM706SARZ-REEL/Analog+Devices/view-part/?ref=eda; Purchase-URL: https://pricing.snapeda.com/search/part/ADM706SARZ-REEL/?ref=eda; Supplier 1: Digi-key; Supplier 2: Arrow Electronics; Supplier 3: Mouser; Supplier Part Number 1: ADM706SARZ-REELCT-ND; Supplier Part Number 2: ADM706SARZ-REEL; Supplier Part Number 3: 584-ADM706SARZ-R; Part Number: ADM706SARZ-REEL; Manufacturer Part Number 1: ADM706SARZ-REEL; Supplier URL 1: https://www.digikey.com/en/products/detail/analog-devices-inc/ADM706SARZ-REEL/993649

## Sheet flyback.SchDoc
size Legal; SheetNumber: 4
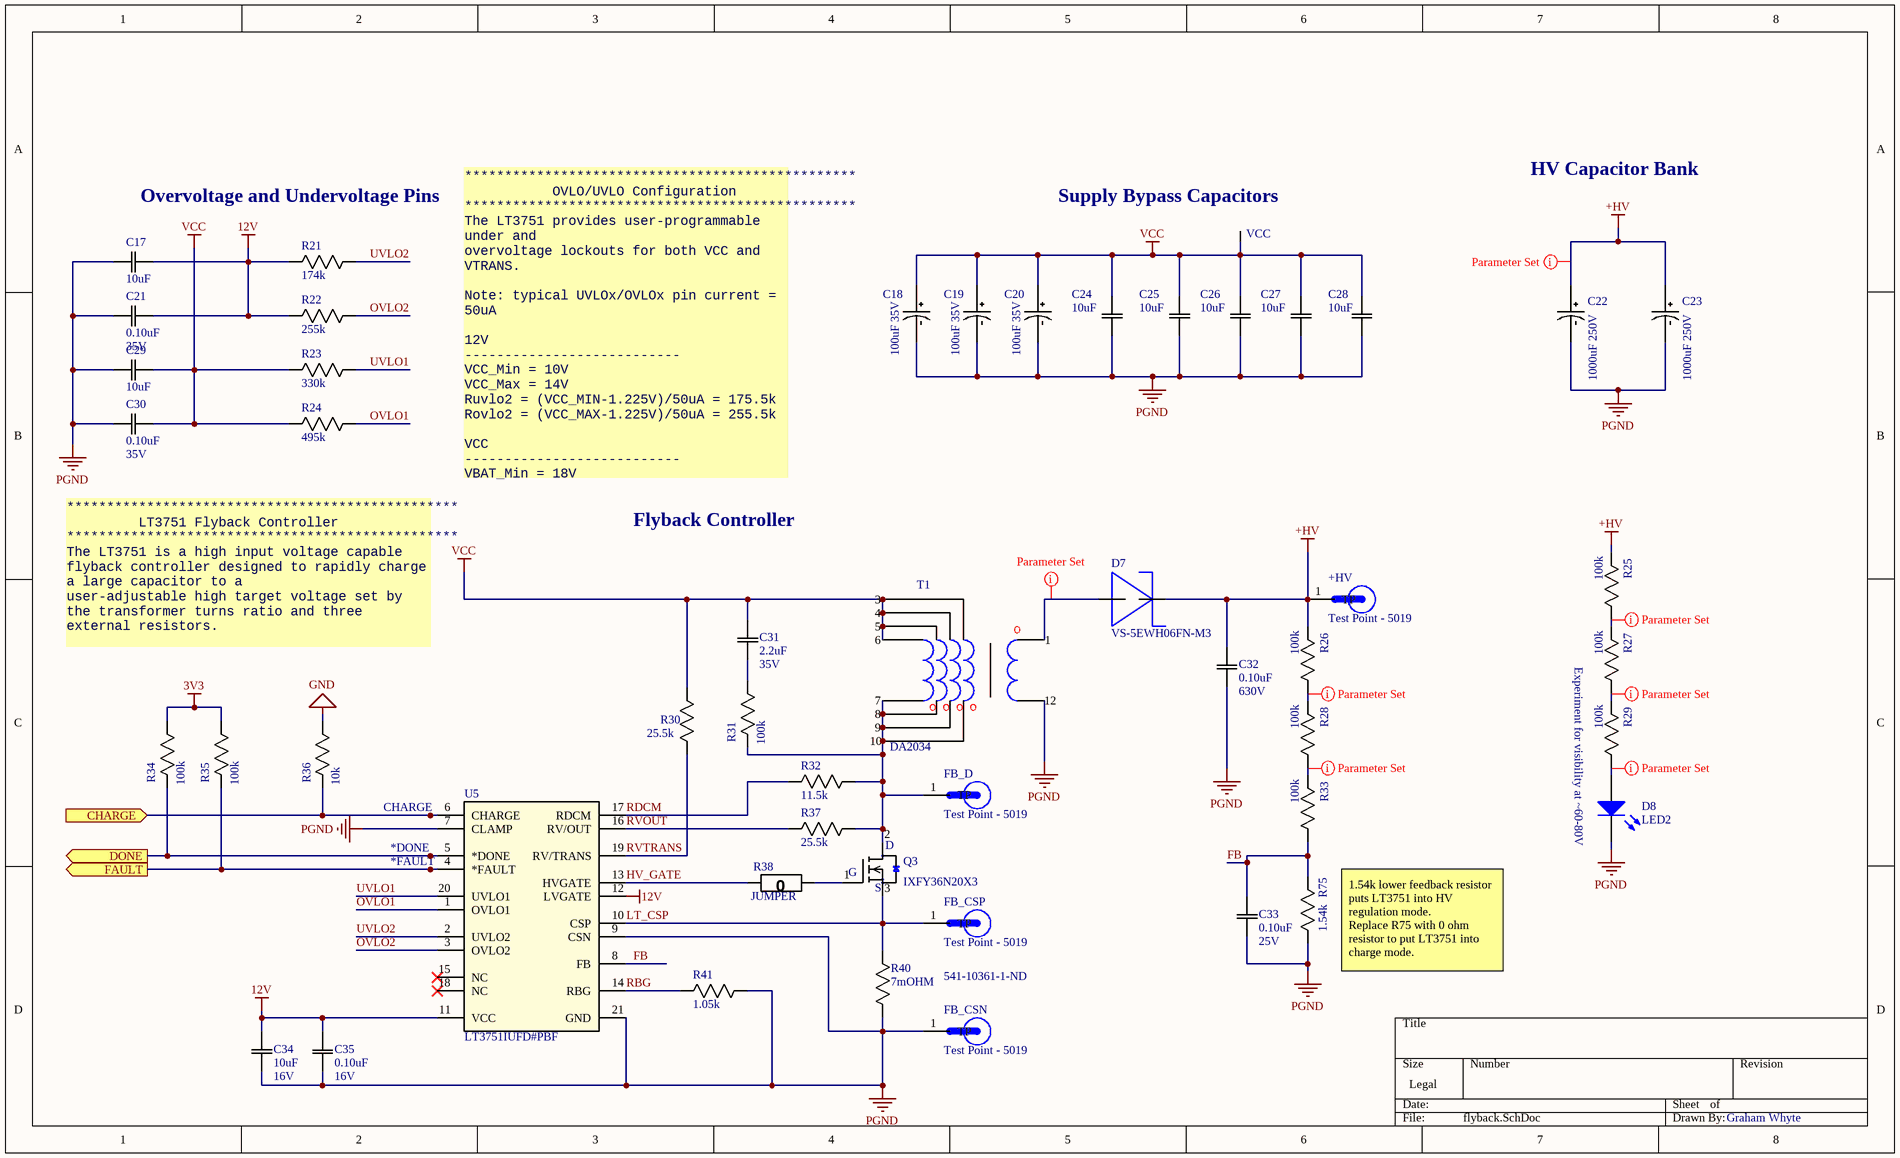
[diagram p5: flyback.SchDoc]

### Parts
*DONE  Test Point (Via)  [TP]  (value not drawn)  (no BOM)
*FAULT  Test Point (Via)  [TP]  (value not drawn)  (no BOM)
+HV  Test Point - 5019  [TP380X203]
C17  10uF  [0805]
C18  100uF 35V  [CAP POL ALU 6.3x5.8]
C19  100uF 35V  [CAP POL ALU 6.3x5.8]
C20  100uF 35V  [CAP POL ALU 6.3x5.8]
C21  Rating: 35V  [0805]  (hidden comment: 0.10uF)
C22  1000uF 250V  [RADIAL, CAN - THRU 25.4mm]
C23  1000uF 250V  [RADIAL, CAN - THRU 25.4mm]
C24  10uF  [0805]
C25  10uF  [0805]
C26  10uF  [0805]
C27  10uF  [0805]
C28  10uF  [0805]
C29  10uF  [0805]
C30  Rating: 35V  [0805]  (hidden comment: 0.10uF)
C31  Rating: 35V  [0603]  (hidden comment: 2.2uF)
C32  Rating: 630V  [1210]  (hidden comment: 0.10uF)
C33  value 0.10uF  Rating: 25V  [0805]  (hidden comment: 0.10uF 25V)
C34  Rating: 16V  [0603]  (hidden comment: 10uF)
C35  Rating: 16V  [0603]  (hidden comment: 0.10uF)
CHARGE  Test Point (Via)  [TP]  (value not drawn)  (no BOM)
D7  VS-5EWH06FN-M3  [DPAK (TO-252)]
D8  LED2  [3.2X1.6X1.1]
FB_CSN  Test Point - 5019  [TP380X203]
FB_CSP  Test Point - 5019  [TP380X203]
FB_D  Test Point - 5019  [TP380X203]
Q3  IXFY36N20X3  [DPAK (TO-252)]
R21  174k  [0603]
R22  255k  [0603]
R23  330k  [0603]
R24  495k  [0603]
R25  100k  [0603]
R26  100k  [0603]
R27  100k  [0603]
R28  100k  [0603]
R29  100k  [0603]
R30  25.5k  [0603]
R31  100k  [0603]
R32  11.5k  [0603]
R33  100k  [0603]
R34  100k  [0603]
R35  100k  [0603]
R36  10k  [0603]
R37  25.5k  [0603]
R38  JUMPER  [0603]
R40  7mOHM  Supplier Part Number 1: 541-10361-1-ND  [2512]
R41  1.05k  [0603]
R75  1.54k  [0603]
T1  DA2034  [DA2034]
U5  LT3751IUFD#PBF  [QFN-20_UFD_LIT-M]
VCC  Test Point (Via)  [TP]  (value not drawn)  (no BOM)

### Ports
CHARGE (in), DONE (out), FAULT (out)

### Nets
3V3: R34.1(R1) R35.1(R1)
12V: C17.2(C2) C21.2(C2) C34.1(C1) C35.2(C2) R21.2(R2) R22.2(R2) U5.11(VCC) U5.12(LVGATE)
+HV: +HV.1(TP) C22.POS C23.POS C32.1(C1) D7.OUT R25.2(R2) R26.2(R2)
GND: R36.1(R1)
PGND: C17.1(C1) C18.NEG C19.NEG C20.NEG C21.1(C1) C22.NEG C23.NEG C24.1(C1) C25.1(C1) C26.1(C1) C27.1(C1) C28.1(C1) C29.1(C1) C30.1(C1) C32.2(C2) C33.2(C2) C34.2(C2) C35.1(C1) D8.2(K) FB_CSN.1(TP) R40.1(R1) R41.1(R1) R75.1(R1) T1.12 U5.7(CLAMP) U5.9(CSN) U5.21(GND)
VCC: C18.POS C19.POS C20.POS C24.2(C2) C25.2(C2) C26.2(C2) C27.2(C2) C28.2(C2) C29.2(C2) C30.2(C2) C31.2(C2) R23.2(R2) R24.2(R2) R30.1(R1) T1.3 T1.4 T1.5 T1.6 VCC.1
CHARGE: CHARGE.1 R36.2(R2) U5.6(CHARGE) ; port CHARGE
DONE: *DONE.1 R34.2(R2) U5.5(*DONE) ; port DONE
FAULT: *FAULT.1 R35.2(R2) U5.4(*FAULT) ; port FAULT
FB: C33.1(C1) R33.1(R1) R75.2(R2) U5.8(FB)
HV_GATE: R38.2(R2) U5.13(HVGATE)
LT_CSP: FB_CSP.1(TP) Q3.3(S) R40.2(R2) U5.10(CSP)
OVLO1: R24.1(R1) U5.1(OVLO1)
OVLO2: R22.1(R1) U5.3(OVLO2)
RBG: R41.2(R2) U5.14(RBG)
RDCM: R32.2(R2) U5.17(RDCM)
RVOUT: R37.2(R2) U5.16(RV/OUT)
RVTRANS: R30.2(R2) U5.19(RV/TRANS)
UVLO1: R23.1(R1) U5.20(UVLO1)
UVLO2: R21.1(R1) U5.2(UVLO2)
NetC31_1: C31.1(C1) R31.1(R1)
NetD7_IN: D7.IN T1.1
NetD8_1: D8.1(A) R29.1(R1)
NetFB_D_1: FB_D.1(TP) Q3.2(D) R31.2(R2) R32.1(R1) R37.1(R1) T1.7 T1.8 T1.9 T1.10
NetQ3_1: Q3.1(G) R38.1(R1)
NetR25_1: R25.1(R1) R27.2(R2)
NetR26_1: R26.1(R1) R28.2(R2)
NetR27_1: R27.1(R1) R29.2(R2)
NetR28_1: R28.1(R1) R33.2(R2)

Not connected (* = marked no-connect by the designer): U5 15(NC)* 18(NC)*

### Layout directives
net class HighVoltage: +HV, NetD7_IN, NetD8_1, NetR25_1, NetR26_1, NetR27_1, NetR28_1

### Notes on the sheet
- Overvoltage and Undervoltage Pins
- (near VCC) Supply Bypass Capacitors
- HV Capacitor Bank
- *************************************************
  OVLO/UVLO Configuration
  *************************************************
  The LT3751 provides user-programmable under and
  overvoltage lockouts for both VCC and VTRANS.
  Note: typical UVLOx/OVLOx pin current = 50uA
  12V
  ---------------------------
  VCC_Min = 10V
  VCC_Max = 14V
  Ruvlo2 = (VCC_MIN-1.225V)/50uA = 175.5k
  Rovlo2 = (VCC_MAX-1.225V)/50uA = 255.5k
  VCC
  ---------------------------
  VBAT_Min = 18V
  VBAT_Max = 26V
  Ruvlo1 = (VBAT_MIN-1.225V)/50uA = 335.5k
  Rovlo1 = (VBAT_MAX-1.225V)/50uA = 495.5k
- Flyback Controller
- *************************************************
  LT3751 Flyback Controller
  *************************************************
  The LT3751 is a high input voltage capable flyback controller designed to rapidly charge a large capacitor to a
  user-adjustable high target voltage set by the transformer turns ratio and three external resistors.
- Experiment for visibility at ~60-80V
- 1.54k lower feedback resistor puts LT3751 into HV regulation mode.
  Replace R75 with 0 ohm resistor to put LT3751 into charge mode.
- Graham Whyte

### Library data of the parts
+HV FB_CSN FB_CSP FB_D = Test Point - 5019: as HB on sheet communication; Value: *; Package: 2010 Keystone; Part Number: Test Point - 5019
C17 C24-C29 = CAP 10uF 35V: CAP CER 10UF 35V X7R 0805; Manufacturer Part Number 1: GRM21BR6YA106KE43L; Tolerance: 10%; Temperature Coefficient: X5R; Package: 0805; Value: 10uF; Rating: 35V; Operating Temperature: -55°C ~ 125°C; Part Number: CAP 10uF 35V; Supplier 1: Digi-Key; Supplier Part Number 1: 490-10514-1-ND
C18-C20 = CAP POL 100uF SMD: CAP ALUM 100UF 35V SMD; Tolerance: 20%; Temperature Coefficient: Unspecified; ComponentLink1Description: Digikey Link; ComponentLink1URL: https://www.digikey.ca/product-detail/en/panasonic-electronic-components/ECA-1HM100I/P10425CT-ND/8603345; Package: RADIAL; Value: 100uF; Rating: 35v; Operating Temperature: -40°C ~ 85°C; Dimensions: 0.197" Dia (5.00mm); Part Number: CAP POL 100uF SMD
C21 C30 = CAP 0.10uF 35V: CAP CER 0.10UF 35V X7R 0805; Manufacturer Part Number 1: GMK107B7104KAHT; Tolerance: 10%; Temperature Coefficient: X7R; Value: 0.10uF; Part Number: CAP 0.10uF 35V; Supplier 1: Digi-Key; Supplier Part Number 1: 587-3354-1-ND; Manufacturer Part Number 2: GMK212BJ104KGHT; Supplier 2: Digi-Key; Supplier Part Number 2: 587-3364-1-ND; Package: 0805; Operating Temperature: -55°C ~ 125°C
C22 C23 = CAP POL 1000uF: United Chemi-Con / ESMQ251VSN102MQ45S; Dielectric Material: Aluminium; Capacitance: 1mF; Tolerance: 20%; Lead Diameter: 2mm; Supplier 1: Digi-Key; Manufacturer: United Chemi-Con; Manufacturer Part Number: ESMQ251VSN102MQ45S; RoHS: Yes; Mount: Through Hole,PCB; Number of Pins: 2; Max Operating Temperature: 85°C; Termination: Radial; Voltage: 250V; Diameter: 25.4mm; Height - Seated (Max): 45mm; Lead Pitch: 10mm; REACH SVHC: No SVHC; Supplier Part Number 1: 565-2754-ND; Part Number: CAP POL 1000uF
C31 = CAP 2.2uF 35V: CAP CER 2.2UF 35V X7R 0603/0805; Manufacturer Part Number 1: C1608X5R1V225K080AC; Tolerance: 10%; Temperature Coefficient: X5R; Package: 0603/0805; Operating Temperature: -55°C ~ 125°C; Value: 2.2uF; Part Number: CAP 2.2uF 35V; Supplier 1: Digi-Key; Supplier Part Number 1: 445-8025-1-ND; Manufacturer Part Number 2: CGA4J1X7R1V225K125AE; Supplier 2: Digi-Key; Supplier Part Number 2: 445-8787-1-ND
C32 = CAP 0.10uF 630V: CAP CER 0.1uF 630V X7R 1210; Tolerance: 10%; Package: 1210; Temperature Coefficient: X7R; Operating Temperature: -55°C ~ 125°C; Value: 0.10uF; Part Number: CAP 0.10uF 630V
C33 = CAP 0.10uF 25V: as C41 on sheet chicker; Temperature Coefficient: X7R; Part Number: CAP 0.10uF 25V; Operating Temperature: -55°C ~ 125°C
C34 = CAP 10uF 16V: CAP CER 10UF 16V X5R 0603/0805; Tolerance: 10%; Package: 0603/0805; Temperature Coefficient: X5R; Operating Temperature: -55°C ~ 85°C; Value: 10uF; Part Number: CAP 10uF 16V
C35 = CAP 0.10uF 16V: as C40 on sheet chicker; Temperature Coefficient: X5R; Value: 0.10uF; Part Number: CAP 0.10uF 16V; Package: 0603/0805; Operating Temperature: -55°C ~ 85°C
D7 = VS-5EWH06FN-M3: Diode Switching 600V 5A DPAK; pin to pad: IN>3 OUT>2; MF: Vishay Diodes; Digikey: VS-5EWH06FN-M3-ND; Digikey Link: https://www.digikey.ca/en/products/detail/vishay-semiconductor-diodes-division/VS-5EWH06FN-M3/4934509; Part Number: VS-5EWH06FN-M3; Pin Count: 2
D8 = LED GREEN SMD: Typical RED, GREEN, YELLOW, AMBER GaAs LED; Package: 1206; Part Number: LED GREEN SMD; Pin Count: 2
Q3 = MOSFET N-CH IXFY36N20X3: N-Channel 200 V 36A (Tc) 176W (Tc) Surface Mount TO-252AA; Supplier 1: Digi-Key; Supplier Part Number 1: IXFY36N20X3-ND; Part Number: MOSFET N-CH IXFY36N20X3; Manufacturer Part Number 1: IXFY36N20X3; Supplier URL 1: https://www.digikey.com/en/products/detail/ixys/IXFY36N20X3/7902311
R21 = RES 174k 1/8W: RES SMD 174K OHM 1% 1/8W 0603; Manufacturer: Yageo; Manufacturer Part Number: RC0805FR-07174KL; Temperature Coefficient: 100ppm/°C; Voltage Rating: 150V; RoHS: Yes; Category: Chip SMD Resistors; Max Operating Temperature: 155°C; Tolerance: 1%; Termination: SMD/SMT; Voltage Rating (DC): 150V; Length: 2mm; Height: 0.024inch; Width: 0.049inch; Depth: 1.25mm; ComponentLink1URL: https://datasheet.ciiva.com/2509/pyu-r-int-thick-7-2509472.pdf?src-supplier=Digi-Key; ComponentLink1Description: https://datasheet.ciiva.com/2509/pyu-r-int-thick-7-2509472.pdf?src-supplier=Digi-Key; ComponentLink2URL: https://datasheet.ciiva.com/2509/pyu-r-int-thick-7-2509471.pdf?src-supplier=Digi-Key; ComponentLink2Description: https://datasheet.ciiva.com/2509/pyu-r-int-thick-7-2509471.pdf?src-supplier=Digi-Key; ComponentLink3URL: https://datasheet.ciiva.com/2509/pyu-r-int-thick-7-2509473.pdf?src-supplier=Digi-Key; ComponentLink3Description: https://datasheet.ciiva.com/2509/pyu-r-int-thick-7-2509473.pdf?src-supplier=Digi-Key; Part Number: RES 174k 1/8W
R22 = RES 255k 1/8W - 1%: RES 255k 1/8W - 1% 0603; Part Number: RES 255k 1/8W - 1%
R23 = RES 330k 1/8W - 1%: RES SMD 274K OHM 1% 1/8W 0603; Part Number: RES 330k 1/8W - 1%
R24 = RES 495k 1/8W: RES SMD 495K OHM 1% 1/8W 0603; Manufacturer: Yageo; Manufacturer Part Number: RC0805FR-07499KL; Temperature Coefficient: 100ppm/°C; Voltage Rating (DC): 150V; RoHS: Yes; Category: Chip SMD Resistors; Max Operating Temperature: 155°C; Termination: SMD/SMT; Tolerance: 1%; Voltage Rating: 150V; Length: 2mm; Depth: 1.25mm; ComponentLink1URL: https://datasheet.ciiva.com/15189/getdatasheetpartid-326570-15189975.pdf?src-supplier=Verical; ComponentLink1Description: https://datasheet.ciiva.com/15189/getdatasheetpartid-326570-15189975.pdf?src-supplier=Verical; Part Number: RES 495k 1/8W
R25 R27 R29 R34 R35 = RES 100k 1/8W - 5%: as R56 on sheet communication; Package: 0805; Value: 100k; Tolerance: 5%; Part Number: RES 100k 1/8W - 5%
R26 R28 R31 R33 = RES 100k 1/8W - 1%: as R46 on sheet auto-discharge; Package: 0805; Value: 100k; Tolerance: 1%; Part Number: RES 100k 1/8W - 1%; Supplier 1: Digi-Key; Supplier Part Number 1: 10-ERJ-H3GJ104VCT-ND; Supplier URL 1: https://www.digikey.ca/en/products/detail/panasonic-electronic-components/ERJ-H3GJ104V/13877854?s=N4IgTCBcDaIIwAYC0BRASgKSQCQMwHENEAWANQGEAVJAOQBEQBdAXyA
R30 R37 = RES 25.5k 1/8W: RES SMD 25.5K OHM 0.1% 1/8W 0603; Manufacturer: Panasonic; Manufacturer Part Number: ERA-6AEB2552V; Temperature Coefficient: 25ppm/°C; Voltage Rating: 100V; RoHS: Yes; Category: Chip SMD Resistors; Mount: Surface Mount; Number of Pins: 2; Max Operating Temperature: 155°C; Tolerance: 0.1%; Termination: Solder; Voltage Rating (DC): 100V; Length: 2mm; Height: 0.5mm; Width: 1.25mm; Depth: 1.25mm; ComponentLink1URL: https://datasheet.ciiva.com/11810/0900766b80eb1d8c-11810651.pdf?src-supplier=RSComponents; ComponentLink1Description: https://datasheet.ciiva.com/11810/0900766b80eb1d8c-11810651.pdf?src-supplier=RSComponents; ComponentLink2URL: https://datasheet.ciiva.com/26335/459526-da-01-en-widerstand-0805-era-26335831.pdf?src-supplier=Conrad; ComponentLink2Description: https://datasheet.ciiva.com/26335/459526-da-01-en-widerstand-0805-era-26335831.pdf?src-supplier=Conrad; ComponentLink3URL: https://datasheet.ciiva.com/7870/485442-7870651.pdf?src-supplier=Element14; ComponentLink3Description: https://datasheet.ciiva.com/7870/485442-7870651.pdf?src-supplier=Element14; ComponentLink4URL: https://datasheet.ciiva.com/5987/485442-5987308.pdf?src-supplier=Farnell; ComponentLink4Description: https://datasheet.ciiva.com/5987/485442-5987308.pdf?src-supplier=Farnell; ComponentLink5URL: https://datasheet.ciiva.com/7870/485442-7870652.pdf?src-supplier=Element14; ComponentLink5Description: https://datasheet.ciiva.com/7870/485442-7870652.pdf?src-supplier=Element14; ComponentLink6URL: https://datasheet.ciiva.com/30151/54aoa0000ce26-30151583.pdf?src-supplier=Onlinecomponents.com; ComponentLink6Description: https://datasheet.ciiva.com/30151/54aoa0000ce26-30151583.pdf?src-supplier=Onlinecomponents.com; Part Number: RES 25.5k 1/8W
R32 = RES 11.5k 1/8W: RES SMD 11.5K OHM 0.1% 1/8W 0603 Thin Film; Manufacturer: Panasonic; Manufacturer Part Number: ERA-6AEB1152V; Voltage Rating: 100V; Temperature Coefficient: 25ppm/°C; Supplier 1: Digi-Key; RoHS: Yes; Category: Chip SMD Resistors; Mount: Surface Mount; Number of Pins: 2; Max Operating Temperature: 155°C; Tolerance: 0.1%; Voltage Rating (DC): 100V; Termination: Solder; Length: 2mm; Height: 0.5mm; Width: 1.25mm; Depth: 1.25mm; ComponentLink1URL: https://datasheet.ciiva.com/11810/0900766b80eb1d8c-11810868.pdf?src-supplier=RSComponents; ComponentLink1Description: https://datasheet.ciiva.com/11810/0900766b80eb1d8c-11810868.pdf?src-supplier=RSComponents; ComponentLink2URL: https://datasheet.ciiva.com/41450/001181306-da-01-en-widerstand-era-0805-11k5-0-1-5000st-41450464.pdf?src-supplier=Conrad; ComponentLink2Description: https://datasheet.ciiva.com/41450/001181306-da-01-en-widerstand-era-0805-11k5-0-1-5000st-41450464.pdf?src-supplier=Conrad; ComponentLink3URL: https://datasheet.ciiva.com/5987/485442-5987301.pdf?src-supplier=Farnell; ComponentLink3Description: https://datasheet.ciiva.com/5987/485442-5987301.pdf?src-supplier=Farnell; ComponentLink4URL: https://datasheet.ciiva.com/7829/485442-7829142.pdf?src-supplier=Element14; ComponentLink4Description: https://datasheet.ciiva.com/7829/485442-7829142.pdf?src-supplier=Element14; ComponentLink5URL: https://datasheet.ciiva.com/17211/aoa0000ce26-17211855.pdf?src-supplier=Avnet+Europe; ComponentLink5Description: https://datasheet.ciiva.com/17211/aoa0000ce26-17211855.pdf?src-supplier=Avnet+Europe; ComponentLink6URL: https://datasheet.ciiva.com/7829/485442-7829143.pdf?src-supplier=Element14; ComponentLink6Description: https://datasheet.ciiva.com/7829/485442-7829143.pdf?src-supplier=Element14; Supplier Part Number 1: P11.5KDACT-ND; Part Number: RES 11.5k 1/8W
R36 = RES 10k 1/8W - 5%: RES SMD 10K OHM 5% 1/8W 0603; Power (Watts): 0.125W; Package: 0805; Value: 10k; Tolerance: 5%; Part Number: RES 10k 1/8W - 5%
R38 = RES 0 JUMPER: RES SMD 0 OHM JUMPER GENERIC 0603; Manufacturer Part Number 1: RK73Z1JTTD; Value: 0; Package: 0805; Part Number: RES 0 JUMPER; Tolerance: N/A; Supplier 1: Digi-Key; Supplier Part Number 1: 2019-RK73Z1JTTDCT-ND; Supplier URL 1: https://www.digikey.ca/en/products/detail/koa-speer-electronics-inc/RK73Z1JTTD/9845478
R40 = RES 7m 3W: RES SMD 7m OHM 1% 3W 2512; MFG: VISHAY; Package: 1206; Power (Watts): 3W; Tolerance: 1%; ComponentLink1Description: Digikey Link; ComponentLink1URL: https://www.digikey.com/en/products/detail/vishay-dale/WFMB2512R0500FEA/9972278; Digikey: 541-10282-1-ND; Supplier 1: Digi-Key; Part Number: RES 7m 3W
R41 = RES 1.05k 1/8W: RES SMD 1.05K OHM 0.1% 1/8W 0603; Value: 1.05k; Package: 0805; Tolerance: 0.1%; Part Number: RES 1.05k 1/8W
R75 = RES 1.54k 1_8W - 1%: RES SMD 1.54k OHM 1% 1/8W 0603; Manufacturer Part Number 1: ERJ-3EKF1541V; Power (Watts): 0.125W; Package: 0603; Value: 1.54k; Tolerance: 1%; Supplier 1: Digi-Key; Supplier Part Number 1: P1.54KHDKR-ND; Part Number: RES 1.54k 1_8W - 1%; Supplier URL 1: https://www.digikey.com/en/products/detail/ERJ-3EKF1541V/P1.54KHDKR-ND/576008?curr=usd&utm_campaign=buynow&utm_medium=aggregator&utm_source=octopart
T1 = DA2034: Audio Transformers / Signal Transformers DA2032 Cap Chrgr For Linear LT3750/51; Supplier 1: Mouser; Supplier Part Number 1: 994-DA2034-ALB; Part Number: DA2034
U5 = LT3751IUFD#PBF: IC CTRLR CAP CHRGR 4.75V 20-QFN; Mfr_Name: Analog Devices / Linear Technology; Copyright: Copyright (C) 2021 Ultra Librarian. All rights reserved.; Manufacturer_Part_Number: lt3751iufd#pbf; Digi-Key_Part_Number_1: LT3751IUFD#PBF-ND; RefDes: RefDes; Type: DEV; Supplier 1: Digi-key; Supplier 2: Arrow Electronics; Supplier 3: Mouser; Supplier Part Number 2: LT3751IUFD#PBF; Part Number: LT3751IUFD#PBF; Manufacturer Part Number 1: LT3751IUFD#PBF; Supplier Part Number 1: LT3751IUFD#PBF-ND; Supplier URL 1: https://www.digikey.com/en/products/detail/analog-devices-inc/LT3751IUFD-PBF/2002312
*DONE *FAULT CHARGE VCC = Test Point (Via): Part Number: Test Point (Via)

## Sheet geneva-interface.SchDoc
size A4
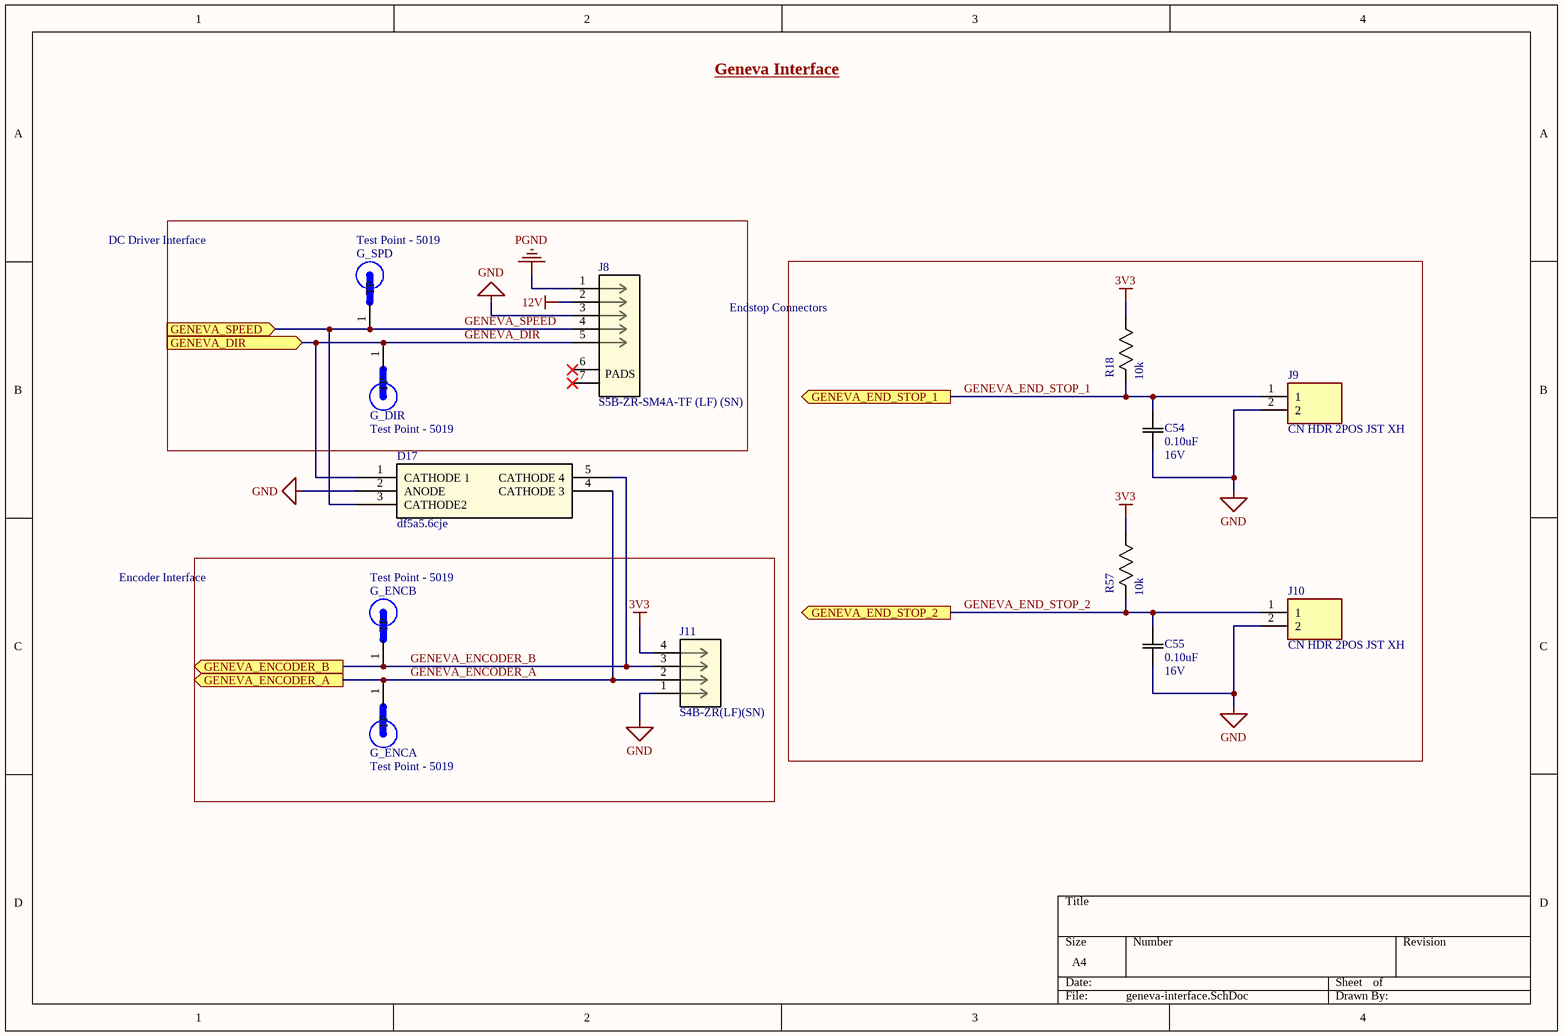
[diagram p6: geneva-interface.SchDoc]

### Parts
(Parts that share a designator on the sheet are numbered #1, #2 ... from top to bottom, then left to right.)
C54  Rating: 16V  [0603]  (hidden comment: 0.10uF)
C55  Rating: 16V  [0603]  (hidden comment: 0.10uF)
D17  df5a5.6cje  [ESV_TOS-L]
G_DIR  Test Point - 5019  [TP380X203]
G_ENCA  Test Point - 5019  [TP380X203]
G_ENCB  Test Point - 5019  [TP380X203]
G_SPD  Test Point - 5019  [TP380X203]
J8  S5B-ZR-SM4A-TF (LF) (SN)  [JST_S5B-ZR-SM4A-TF]
J9  CN HDR 2POS JST XH  [JST_S2B-XH-A(LF)(SN)]
J10  CN HDR 2POS JST XH  [JST_S2B-XH-A(LF)(SN)]
J11  S4B-ZR(LF)(SN)  [CN S4B-ZR(LF)(SN)_JST]
R18#1  10k  [0603]
R57  10k  [0603]

### Blocks framed on the sheet
DC Driver Interface: G_DIR G_SPD J8
Endstop Connectors: C54 C55 J9 J10 R18#1 R57
Encoder Interface: G_ENCA G_ENCB J11

### Ports
GENEVA_DIR (in), GENEVA_ENCODER_A (out), GENEVA_ENCODER_B (out), GENEVA_END_STOP_1 (out), GENEVA_END_STOP_2 (out), GENEVA_SPEED (in)

### Nets
3V3: J11.4 R18#1.1(R1) R57.1(R1)
12V: J8.2
GND: C54.2(C2) C55.2(C2) D17.2(ANODE) J8.3 J9.2 J10.2 J11.1
PGND: J8.1
GENEVA_DIR: D17.1(CATHODE_1) G_DIR.1(TP) J8.5 ; port GENEVA_DIR
GENEVA_ENCODER_A: D17.4(CATHODE_3) G_ENCA.1(TP) J11.2 ; port GENEVA_ENCODER_A
GENEVA_ENCODER_B: D17.5(CATHODE_4) G_ENCB.1(TP) J11.3 ; port GENEVA_ENCODER_B
GENEVA_END_STOP_1: C54.1(C1) J9.1 R18#1.2(R2) ; port GENEVA_END_STOP_1
GENEVA_END_STOP_2: C55.1(C1) J10.1 R57.2(R2) ; port GENEVA_END_STOP_2
GENEVA_SPEED: D17.3(CATHODE2) G_SPD.1(TP) J8.4 ; port GENEVA_SPEED

Not connected (* = marked no-connect by the designer): J8 6* 7*

### Notes on the sheet
- Geneva Interface
- (in symbol CN 5POS JST ZR RA) PADS

### Library data of the parts
C54 C55 = CAP 0.10uF 16V: as C40 on sheet chicker; Package: 0603/0805; Temperature Coefficient: X5R; Operating Temperature: -55°C ~ 85°C; Value: 0.10uF; Part Number: CAP 0.10uF 16V
D17 = DIODE TVS 3.5 VWM 4 Channel: - Clamp - Ipp Tvs Diode Surface Mount ESV 4 Channel; Mfr_Name: Toshiba Electronic Devices & Storage Co.; Manufacturer_Part_Number: df5a5.6cje(te85l; Manufacturer Part Number 1: DF5A5.6CJE,LM; Type: DEV; Copyright: Copyright (C) 2021 Ultra Librarian. All rights reserved.; Digi-Key_Part_Number_1: DF5A5.6CJE(TE85LF)TR-ND; Digi-Key_Part_Number_2: DF5A5.6CJE(TE85LF)CT-ND; Digi-Key_Part_Number_3: DF5A5.6CJE(TE85LF)DKR-ND; RefDes: RefDes; Supplier 1: Digi-Key; Supplier Part Number 1: DF5A5.6CJE,LMCT-ND; Part Number: DIODE TVS 3.5 VWM 4 Channel; Supplier URL 1: https://www.digikey.com/en/products/detail/toshiba-semiconductor-and-storage/DF5A5-6CJE-LM/4305072
G_DIR G_ENCA G_ENCB G_SPD = Test Point - 5019: as HB on sheet communication; Value: *; Package: 2010 Keystone; Part Number: Test Point - 5019
J8 = CN 5POS JST ZR RA: Connector Header Surface Mount, Right Angle 5 position 0.059" (1.50mm); Supplier 1: Digi-Key; Supplier Part Number 1: 455-1696-1-ND; Part Number: CN 5POS JST ZR RA; Manufacturer Part Number 1: S5B-ZR-SM4A-TF; Supplier URL 1: https://www.digikey.ca/en/products/detail/jst-sales-america-inc/S5B-ZR-SM4A-TF-LF-SN/926603?s=N4IgTCBcDaICwFYEFoCMA2AnOtyByAIiALoC%2BQA; Pin Count: 5
J9 J10 = CN HDR 2POS JST XH: as J7 on sheet breakbeam-interface; Price: None; Package: None; Value: *; SnapEDA_Link: https://www.snapeda.com/parts/B2B-XH-A%28LF%29%28SN%29/JST%20Sales%20America%20Inc./view-part/492310/?ref=snap; Part Number: CN HDR 2POS JST XH; Pin Count: 2
J11 = CN HDR 4POS JST ZR: Connector Header Through Hole, Right Angle 4 position 0.059" (1.50mm); Mfr_Name: JST; Copyright: Copyright (C) 2021 Ultra Librarian. All rights reserved.; Manufacturer_Part_Number: S4B-ZR(LF)(SN); Digi-Key_Part_Number_1: 455-1671-ND; RefDes: RefDes; Type: DEV; Supplier 1: Digi-Key; Supplier Part Number 1: 455-1671-ND; Part Number: CN HDR 4POS JST ZR; Manufacturer Part Number 1: S4B-ZR(LF)(SN); Supplier URL 1: https://www.digikey.com/en/products/detail/jst-sales-america-inc/S4B-ZR-LF-SN/926578
R18#1 R57 = RES 10k 1/8W - 5%: as R36 on sheet flyback; Package: 0805; Value: 10k; Tolerance: 5%; Part Number: RES 10k 1/8W - 5%